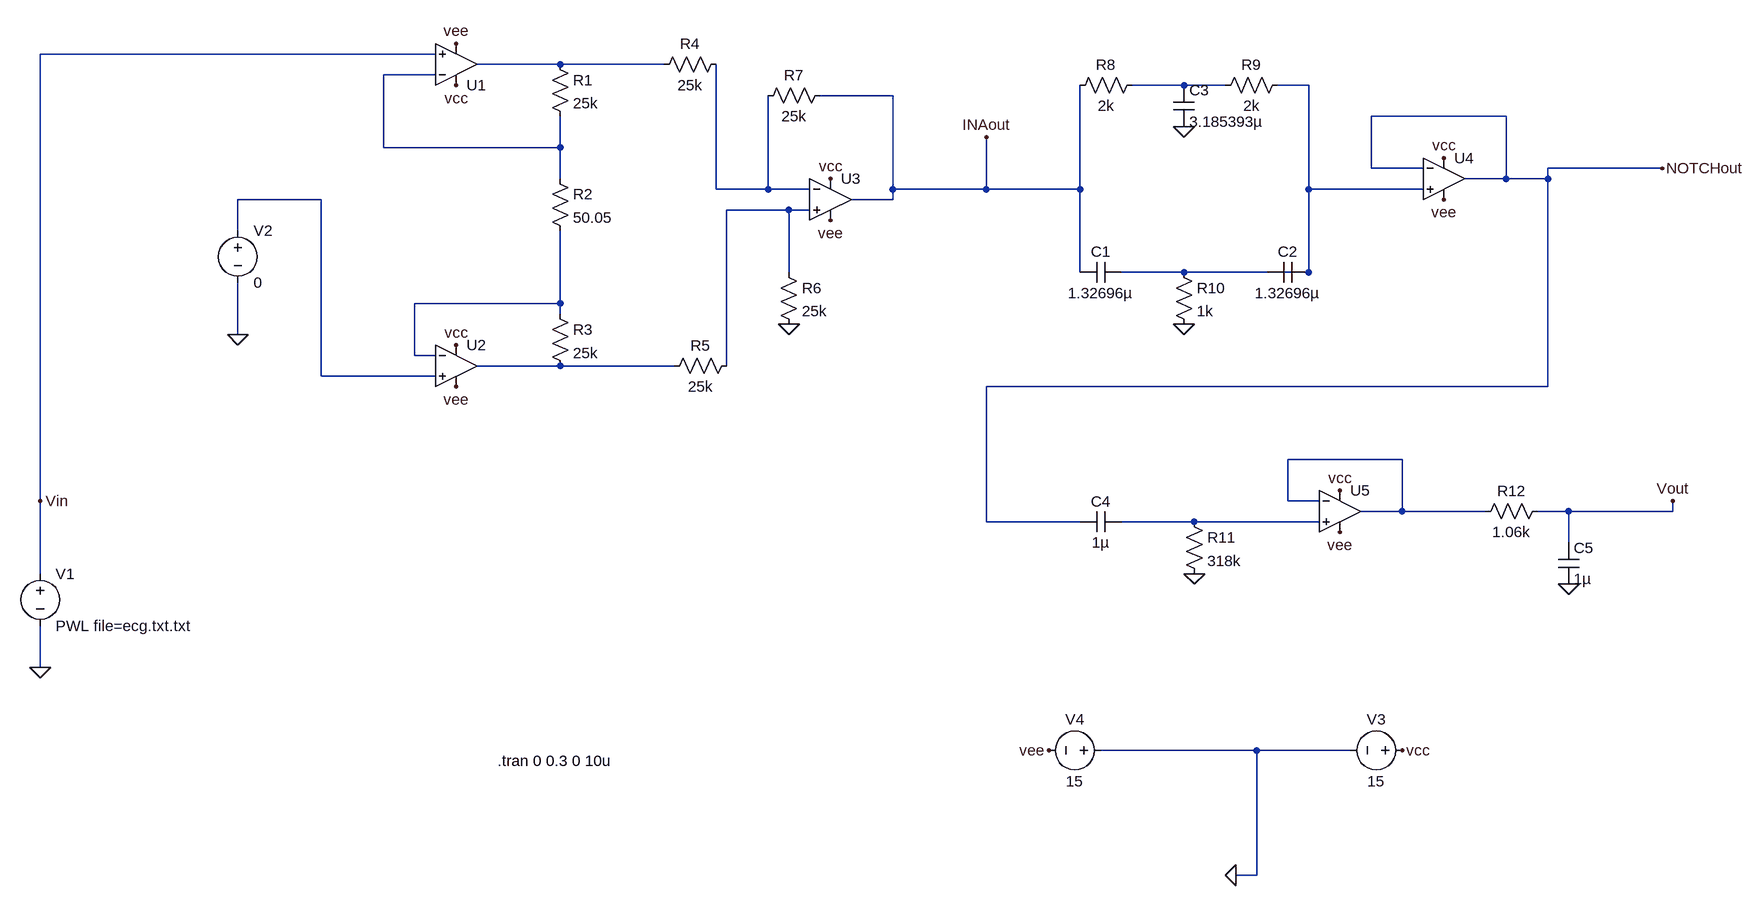
[diagram p0: schematic ecg_simulation.asc]
ecg_simulation.asc, the LTspice schematic file:
Version 4.1
SHEET 1 4852 772
WIRE -544 -512 -1152 -512
WIRE -352 -496 -480 -496
WIRE -192 -496 -352 -496
WIRE -544 -480 -624 -480
WIRE 608 -464 528 -464
WIRE 672 -464 608 -464
WIRE 800 -464 752 -464
WIRE 160 -448 48 -448
WIRE 1104 -416 896 -416
WIRE -624 -368 -624 -480
WIRE -352 -368 -352 -416
WIRE -352 -368 -624 -368
WIRE 896 -336 896 -416
WIRE 976 -336 896 -336
WIRE 1344 -336 1168 -336
WIRE -352 -320 -352 -368
WIRE 1104 -320 1104 -416
WIRE 1104 -320 1040 -320
WIRE 1168 -320 1168 -336
WIRE 1168 -320 1104 -320
WIRE -112 -304 -112 -496
WIRE -32 -304 -32 -448
WIRE -32 -304 -112 -304
WIRE 32 -304 -32 -304
WIRE 160 -304 160 -448
WIRE 304 -304 304 -384
WIRE 304 -304 160 -304
WIRE 448 -304 448 -464
WIRE 448 -304 304 -304
WIRE 800 -304 800 -464
WIRE 976 -304 800 -304
WIRE -720 -288 -848 -288
WIRE 160 -288 160 -304
WIRE 160 -288 96 -288
WIRE 0 -272 -96 -272
WIRE 32 -272 0 -272
WIRE -848 -240 -848 -288
WIRE 0 -176 0 -272
WIRE 448 -176 448 -304
WIRE 608 -176 512 -176
WIRE 736 -176 608 -176
WIRE 800 -176 800 -304
WIRE 800 -176 752 -176
WIRE -352 -128 -352 -240
WIRE -352 -128 -576 -128
WIRE -352 -112 -352 -128
WIRE -848 -80 -848 -160
WIRE -576 -48 -576 -128
WIRE -544 -48 -576 -48
WIRE -352 -32 -480 -32
WIRE -176 -32 -352 -32
WIRE -96 -32 -96 -272
WIRE -720 -16 -720 -288
WIRE -544 -16 -720 -16
WIRE 1168 0 1168 -320
WIRE 1168 0 304 0
WIRE 944 112 768 112
WIRE -1152 176 -1152 -512
WIRE 768 176 768 112
WIRE 816 176 768 176
WIRE 944 192 944 112
WIRE 944 192 880 192
WIRE 1072 192 944 192
WIRE 1200 192 1152 192
WIRE 1360 192 1360 176
WIRE 1360 192 1200 192
WIRE 304 208 304 0
WIRE 448 208 304 208
WIRE 624 208 512 208
WIRE 816 208 624 208
WIRE 1200 240 1200 192
WIRE -1152 288 -1152 176
WIRE -1152 432 -1152 368
WIRE 720 560 480 560
WIRE 864 560 720 560
WIRE 720 752 720 560
WIRE 720 752 688 752
FLAG -512 -64 vcc
FLAG 64 -320 vcc
FLAG -512 0 vee
FLAG 64 -256 vee
FLAG -512 -464 vcc
FLAG -512 -528 vee
FLAG 1008 -352 vcc
FLAG 1008 -288 vee
FLAG 848 160 vcc
FLAG 848 224 vee
FLAG 1360 176 Vout
FLAG 608 -400 0
FLAG 608 -96 0
FLAG 624 288 0
FLAG 1200 304 0
FLAG 0 -96 0
FLAG -1152 432 0
FLAG -848 -80 0
FLAG 688 752 0
FLAG 400 560 vee
FLAG 944 560 vcc
FLAG 304 -384 INAout
FLAG 1344 -336 NOTCHout
FLAG -1152 176 Vin
SYMBOL res -368 -512 R0
SYMATTR InstName R1
SYMATTR Value 25k
SYMBOL res -368 -336 R0
SYMATTR InstName R2
SYMATTR Value 50.05
SYMBOL res -368 -128 R0
SYMATTR InstName R3
SYMATTR Value 25k
SYMBOL res -96 -512 R90
WINDOW 0 0 56 VBottom 2
WINDOW 3 32 56 VTop 2
SYMATTR InstName R4
SYMATTR Value 25k
SYMBOL res -80 -48 R90
WINDOW 0 0 56 VBottom 2
WINDOW 3 32 56 VTop 2
SYMATTR InstName R5
SYMATTR Value 25k
SYMBOL res -16 -192 R0
SYMATTR InstName R6
SYMATTR Value 25k
SYMBOL res 64 -464 R90
WINDOW 0 0 56 VBottom 2
WINDOW 3 32 56 VTop 2
SYMATTR InstName R7
SYMATTR Value 25k
SYMBOL res 544 -480 R90
WINDOW 0 0 56 VBottom 2
WINDOW 3 32 56 VTop 2
SYMATTR InstName R8
SYMATTR Value 2k
SYMBOL res 768 -480 R90
WINDOW 0 0 56 VBottom 2
WINDOW 3 32 56 VTop 2
SYMATTR InstName R9
SYMATTR Value 2k
SYMBOL cap 512 -192 R90
WINDOW 0 0 32 VBottom 2
WINDOW 3 32 32 VTop 2
SYMATTR InstName C1
SYMATTR Value 1.32696µ
SYMBOL cap 800 -192 R90
WINDOW 0 0 32 VBottom 2
WINDOW 3 32 32 VTop 2
SYMATTR InstName C2
SYMATTR Value 1.32696µ
SYMBOL res 592 -192 R0
SYMATTR InstName R10
SYMATTR Value 1k
SYMBOL cap 592 -464 R0
SYMATTR InstName C3
SYMATTR Value 3.185393µ
SYMBOL cap 512 192 R90
WINDOW 0 0 32 VBottom 2
WINDOW 3 32 32 VTop 2
SYMATTR InstName C4
SYMATTR Value 1µ
SYMBOL res 608 192 R0
SYMATTR InstName R11
SYMATTR Value 318k
SYMBOL res 1168 176 R90
WINDOW 0 0 56 VBottom 2
WINDOW 3 32 56 VTop 2
SYMATTR InstName R12
SYMATTR Value 1.06k
SYMBOL cap 1184 240 R0
SYMATTR InstName C5
SYMATTR Value 1µ
SYMBOL OpAmps\\UniversalOpAmp2 -512 -32 R0
SYMATTR InstName U2
SYMBOL OpAmps\\UniversalOpAmp2 64 -288 R0
SYMATTR InstName U3
SYMBOL OpAmps\\UniversalOpAmp2 1008 -320 R0
SYMATTR InstName U4
SYMBOL OpAmps\\UniversalOpAmp2 848 192 R0
SYMATTR InstName U5
SYMBOL OpAmps\\UniversalOpAmp2 -512 -496 M180
SYMATTR InstName U1
SYMBOL voltage -1152 272 R0
WINDOW 123 24 44 Left 2
WINDOW 39 0 0 Left 0
SYMATTR InstName V1
SYMATTR Value PWL file=ecg.txt.txt
SYMBOL voltage -848 -256 R0
WINDOW 123 0 0 Left 0
WINDOW 39 0 0 Left 0
SYMATTR InstName V2
SYMATTR Value 0
SYMBOL voltage 960 560 R90
WINDOW 0 -32 56 VBottom 2
WINDOW 3 32 56 VTop 2
SYMATTR InstName V3
SYMATTR Value 15
SYMBOL voltage 496 560 R90
WINDOW 0 -32 56 VBottom 2
WINDOW 3 32 56 VTop 2
SYMATTR InstName V4
SYMATTR Value 15
TEXT -448 576 Left 2 !.tran 0 0.3 0 10u

The netlist it stands for:
* ecg_simulation.asc
R1 N001 N002 25k
R2 N002 N009 50.05
R3 N009 N010 25k
R4 N005 N001 25k
R5 N007 N010 25k
R6 N007 0 25k
R7 INAout N005 25k
R8 N003 INAout 2k
R9 N004 N003 2k
C1 N008 INAout 1.32696µ
C2 N004 N008 1.32696µ
R10 N008 0 1k
C3 N003 0 3.185393µ
C4 N012 NOTCHout 1µ
R11 N012 0 318k
R12 Vout N011 1.06k
C5 Vout 0 1µ
X§U2 N006 N009 vcc vee N010 level2 Avol=1Meg GBW=10Meg Slew=10Meg Ilimit=25m Rail=0 Vos=0 En=0 Enk=0 In=0 Ink=0 Rin=500Meg  ; pins In+ In- V+ V- OUT
X§U3 N007 N005 vcc vee INAout level2 Avol=1Meg GBW=10Meg Slew=10Meg Ilimit=25m Rail=0 Vos=0 En=0 Enk=0 In=0 Ink=0 Rin=500Meg  ; pins In+ In- V+ V- OUT
X§U4 N004 NOTCHout vcc vee NOTCHout level2 Avol=1Meg GBW=10Meg Slew=10Meg Ilimit=25m Rail=0 Vos=0 En=0 Enk=0 In=0 Ink=0 Rin=500Meg  ; pins In+ In- V+ V- OUT
X§U5 N012 N011 vcc vee N011 level2 Avol=1Meg GBW=10Meg Slew=10Meg Ilimit=25m Rail=0 Vos=0 En=0 Enk=0 In=0 Ink=0 Rin=500Meg  ; pins In+ In- V+ V- OUT
X§U1 Vin N002 vcc vee N001 level2 Avol=1Meg GBW=10Meg Slew=10Meg Ilimit=25m Rail=0 Vos=0 En=0 Enk=0 In=0 Ink=0 Rin=500Meg  ; pins In+ In- V+ V- OUT
V1 Vin 0 PWL file=ecg.txt.txt
V2 N006 0 0
V3 vcc 0 15
V4 0 vee 15
.tran 0 0.3 0 10u
.lib UniversalOpAmp2.lib
.backanno
.end